# Altium schematic sheet PCIE.schdoc: =
size A4; Symbol: Sheet-Symbol_A4; Company: 嘉立创EDA; Version: V1.0; Page Size: A4; @Project Name: RK3568B2地瓜派; @Page Count: 27; @Update Date: 2025-09-15; @Create Date: 2025-09-12; @Schematic Name: Schematic1; @Page No: 27; @Page Name: PCIE; Device: Sheet-Symbol_A4; Border: 1; Title Block Position: 3; Width: 1170; Height: 825; Region Start: 1; X Region Count: 6; Y Region Count: 4; Blade Width: 10; @Board Name: Board1; @Create Time: 09:37:39; @Update Time: 13:48:42; Organization: ORGANIZATION; Address1: ADDRESS 1; Address2: ADDRESS 2; Address3: ADDRESS 3; Address4: ADDRESS 4; SheetNumber: 18; SheetTotal: 28
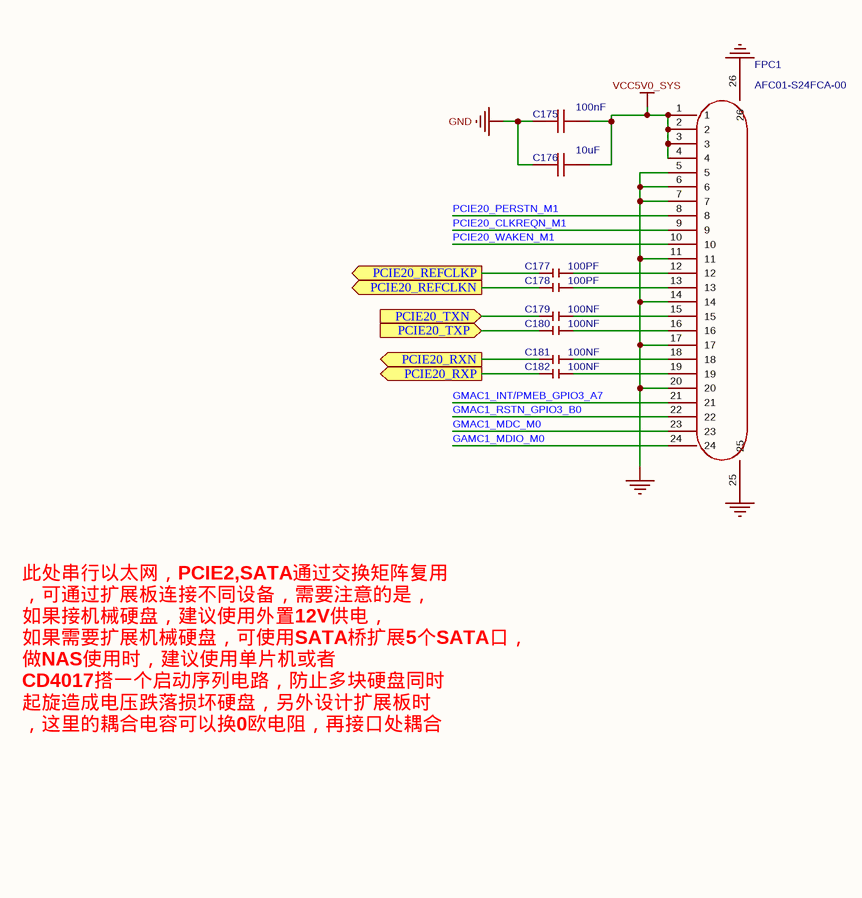
[diagram p0: PCIE.schdoc]

## Parts
C175  100nF  [C0603]
C176  10uF  [C0603]
C177  100PF  [MYC0402]
C178  100PF  [MYC0402]
C179  100NF  [MYC0402]
C180  100NF  [MYC0402]
C181  100NF  [MYC0402]
C182  100NF  [MYC0402]
FPC1  AFC01-S24FCA-00  [FPC-SMD_24P-P0.50_AFC01-S24FCA-00]

## Ports
PCIE20_REFCLKN (out), PCIE20_REFCLKP (out), PCIE20_RXN (out), PCIE20_RXP (out), PCIE20_TXN (in), PCIE20_TXP (in)

## Nets
GND: C175.1 C176.1 FPC1.5 FPC1.6 FPC1.7 FPC1.11 FPC1.14 FPC1.17 FPC1.20 FPC1.25 FPC1.26
VCC5V0_SYS: C175.2 C176.2 FPC1.1 FPC1.2 FPC1.3 FPC1.4
GAMC1_MDIO_M0: FPC1.24
GMAC1_INT/PMEB_GPIO3_A7: FPC1.21
GMAC1_MDC_M0: FPC1.23
GMAC1_RSTN_GPIO3_B0: FPC1.22
PCIE20_CLKREQN_M1: FPC1.9
PCIE20_PERSTN_M1: FPC1.8
PCIE20_REFCLKN: C178.1 ; port PCIE20_REFCLKN
PCIE20_REFCLKP: C177.1 ; port PCIE20_REFCLKP
PCIE20_RXN: C181.1 ; port PCIE20_RXN
PCIE20_RXP: C182.1 ; port PCIE20_RXP
PCIE20_TXN: C179.1 ; port PCIE20_TXN
PCIE20_TXP: C180.1 ; port PCIE20_TXP
PCIE20_WAKEN_M1: FPC1.10
NetC177_2: C177.2 FPC1.12
NetC178_2: C178.2 FPC1.13
NetC179_2: C179.2 FPC1.15
NetC180_2: C180.2 FPC1.16
NetC181_2: C181.2 FPC1.18
NetC182_2: C182.2 FPC1.19

## Notes on the sheet
- 此处串行以太网，PCIE2,SATA通过交换矩阵复用
  ，可通过扩展板连接不同设备，需要注意的是，
  如果接机械硬盘，建议使用外置12V供电，
  如果需要扩展机械硬盘，可使用SATA桥扩展5个SATA口，
  做NAS使用时，建议使用单片机或者
  CD4017搭一个启动序列电路，防止多块硬盘同时
  起旋造成电压跌落损坏硬盘，另外设计扩展板时
  ，这里的耦合电容可以换0欧电阻，再接口处耦合
- Drawn By :
- Checked By :
- Approved By :
- SheetNumber
- SheetTotal
- Revision :
- Time :
- Size :
- Date :
- A4
- DocumentName :
- Project :

## Library data of the parts
C175 C176 = CAP_0603: Symbol: Capacitance; ConvertToPcb: yes; ModelId: ac125912035d415993ca9572d50418b1聨0819f05c4eef4c71ace90d822a990e87; ModelName: C0603_L1.6-W0.8-H0.8; ModelTransform: 62.992,31.496,0,0,0,0,0,0,0; Device: CAP_0603; AddInBom: yes; Supplier Footprint: 0603; FootprintName: C0603
  C175: Value: 100nF
  C176: Value: 10uF
C177-C182 = MYC0402: C0402电容; Symbol: MY_C0201; AddInBom: yes; Device: MYC0402; ConvertToPcb: yes; FootprintName: MYC0402
  C177 C178: Value: 100PF
  C179-C182: Value: 100NF
FPC1 = AFC01-S24FCA-00: 锁定特性:翻盖式;触点类型:下接;触点数量:24P;间距:0.5mm;安装方式:卧贴;; Manufacturer: JS(钜硕电子); AddInBom: yes; ModelId: f4bf300ddc81445bb004d4c904d70ad0; ModelTransform: 645.668,240.157,0,0,0,0,0,-52.441,0; Locking Feature: 翻盖式; Number of Contacts: 24P; Pitch: 0.5mm; FFC, FCB Thickness: 0.3mm; Symbol: AFC01-S24FCA-00; Device: AFC01-S24FCA-00; LCSC Part Name: 间距:0.5mm P数:24P 翻盖式 下接; SupplierPart: C262669; ManufacturerPart: AFC01-S24FCA-00; Supplier Footprint: SMD,P=0.5mm,卧贴; JLCPCB Part Class: 扩展库; Datasheet: https://item.szlcsc.com/datasheet/AFC01-S24FCA-00/253928.html; Supplier: LCSC; ConvertToPcb: yes; FootprintName: FPC-SMD_24P-P0.50_AFC01-S24FCA-00; ModelName: FPC-SMD_24P-P0.50_AFC01-S24FCA-00; Contact Type: 下接; Mounting Type: 卧贴; Height Above Board: 2mm